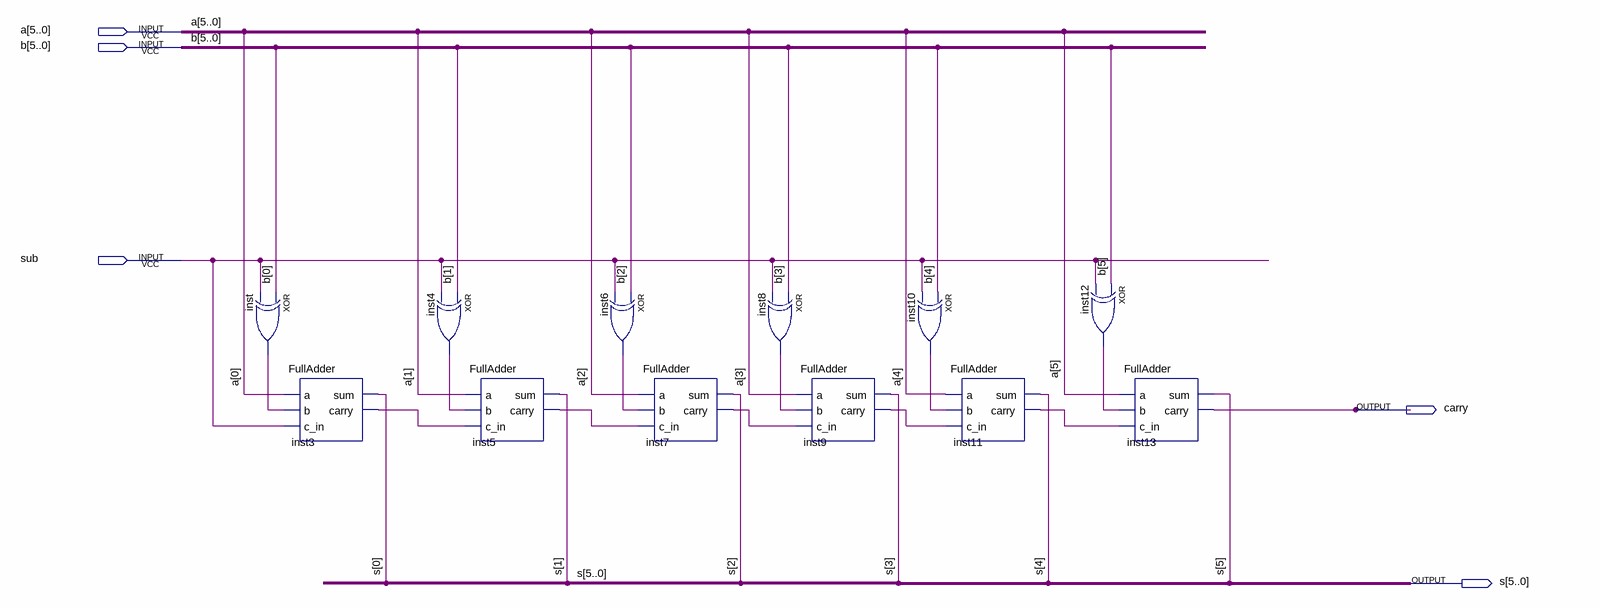
[diagram p0: schematic sheet]
// Quartus schematic RippleCarryAdder6bit.bdf as structural Verilog: 12 symbols, 5 pins
module RippleCarryAdder6bit (
  input  [5:0] a,
  input  [5:0] b,
  input  sub,
  output carry,
  output [5:0] s
);

  wire inst3_carry, inst4_out, inst5_carry, inst6_out, inst7_carry, inst8_out, inst9_carry, inst10_out,
       inst11_carry, inst12_out, inst_out;

  xor inst (inst_out, b[0], sub);
  FullAdder inst3 (.a(a[0]), .b(inst_out), .c_in(sub), .sum(s[0]), .carry(inst3_carry));
  xor inst4 (inst4_out, b[1], sub);
  FullAdder inst5 (.a(a[1]), .b(inst4_out), .c_in(inst3_carry), .sum(s[1]), .carry(inst5_carry));
  xor inst6 (inst6_out, b[2], sub);
  FullAdder inst7 (.a(a[2]), .b(inst6_out), .c_in(inst5_carry), .sum(s[2]), .carry(inst7_carry));
  xor inst8 (inst8_out, b[3], sub);
  FullAdder inst9 (.a(a[3]), .b(inst8_out), .c_in(inst7_carry), .sum(s[3]), .carry(inst9_carry));
  xor inst10 (inst10_out, b[4], sub);
  FullAdder inst11 (.a(a[4]), .b(inst10_out), .c_in(inst9_carry), .sum(s[4]), .carry(inst11_carry));
  xor inst12 (inst12_out, b[5], sub);
  FullAdder inst13 (.a(a[5]), .b(inst12_out), .c_in(inst11_carry), .sum(s[5]), .carry(carry));
endmodule
